# EAGLE design gyro (EAGLE 9.4.2)
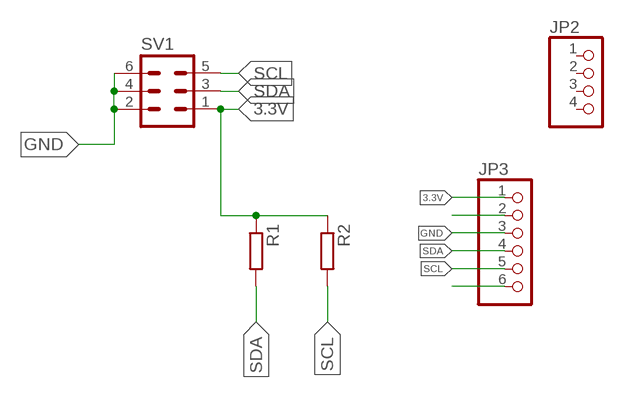
[diagram p0: schematic, sheet 1]

## Parts
JP2  PINHD-1X4  [1X04]
JP3  PINHD-1X6  [1X06]
R1  R-EU_0309/12  [0309/12]
R2  R-EU_0309/12  [0309/12]
SV1  ML6  [ML6]

## Nets
3.3V: JP3.1 R1.1 R2.1 SV1.1
GND: JP3.3 SV1.2 SV1.4 SV1.6
N$2: JP3.2
N$6: JP3.6
SCL: JP3.5 R2.2 SV1.5
SDA: JP3.4 R1.2 SV1.3
Unconnected: JP2.1 JP2.2 JP2.3 JP2.4

## Library data of the parts
JP2 = pinhead:PINHD-1X4: PIN HEADER
JP3 = pinhead:PINHD-1X6: PIN HEADER
R1 R2 = rcl:R-EU_: RESISTOR, European symbol; SPICEPREFIX: R
SV1 = con-ml:ML6: HARTING; OC_FARNELL: unknown; OC_NEWARK: unknown

## Board
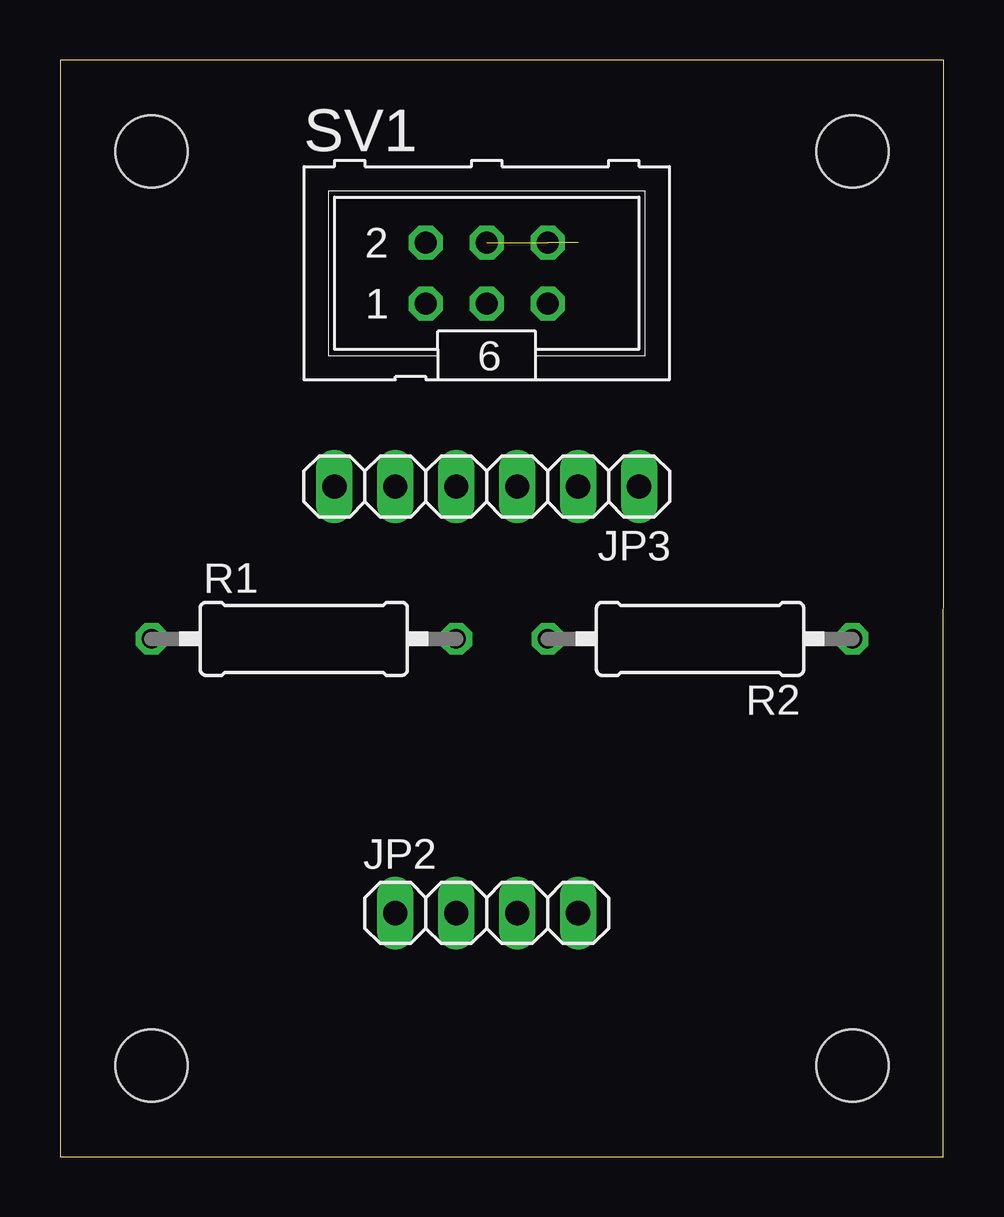
[diagram p1: board, top side]
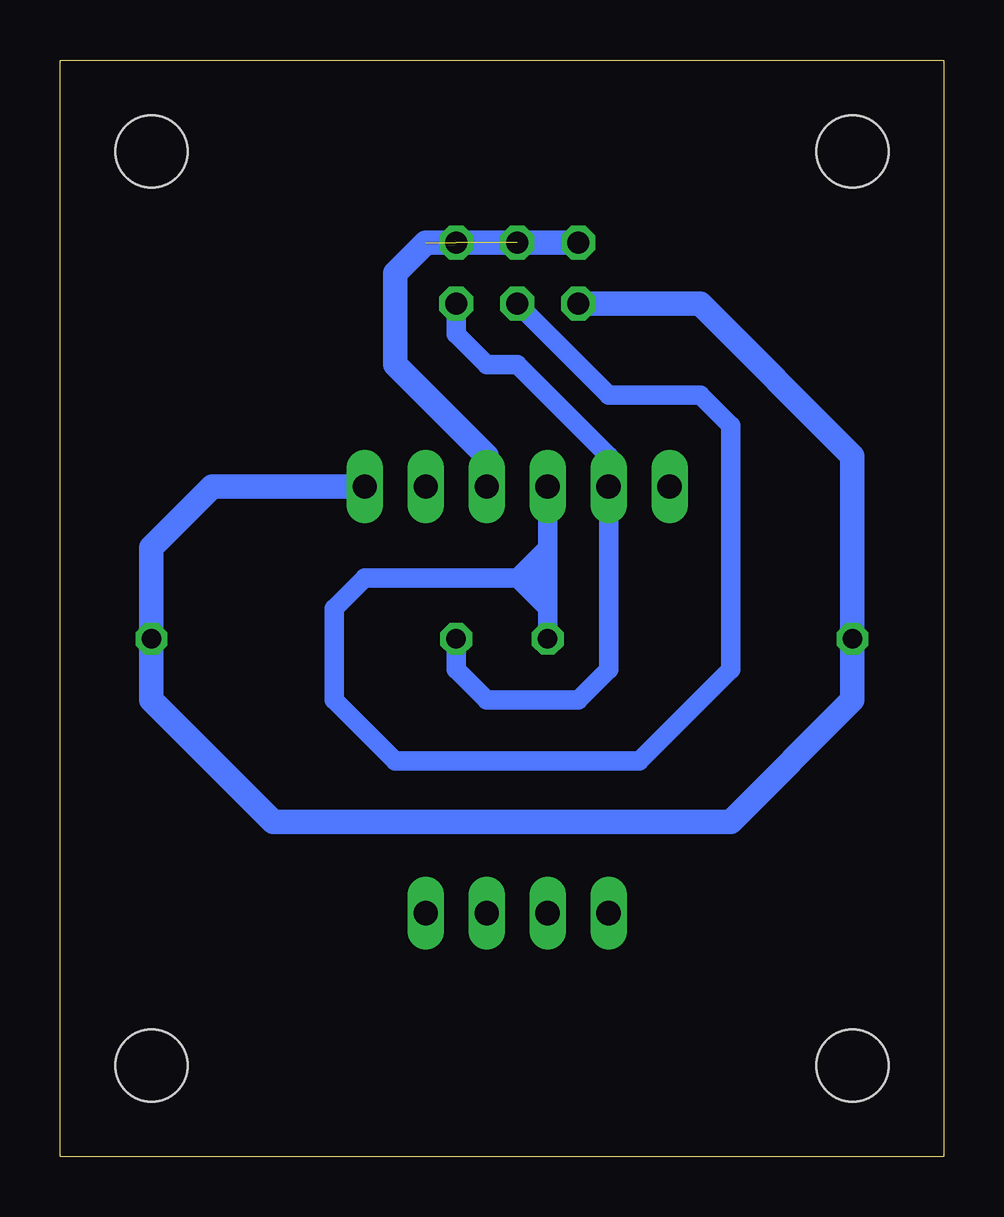
[diagram p2: board, bottom side, seen from below]

Size 36.83 x 45.72 mm. Coordinates in mm from the lower left corner, seen from the top.
Outline: 0,0 36.81,0 36.83,45.72 0,45.72 0,0
Copper layers (1*16): Top 0.035mm / dielectric 1.5mm / Bottom 0.035mm
Design rules "default": minimum track width 6mil, minimum drill 0.35mm, track to track 6mil, track to pad 6mil, pad to pad 6mil, via to via 6mil, smd to smd 6mil, copper to edge 40mil, drill to drill 6mil, minimum pad ring 10mil, minimum via ring 8mil, stop-mask expansion 4mil, vias tented up to drill 0mil, thermal gap 10mil
Holes 3 mm at 3.81,3.81 33.02,3.81 3.81,41.91 33.02,41.91

### Footprints (pad centres in the part's own frame; a part is rotated, then mirrored left to right if it is on the bottom)
1X04 = drill 1.016 long: 1 -3.81,0; 2 -1.27,0; 3 1.27,0; 4 3.81,0
1X06 = drill 1.016 long: 1 -6.35,0; 2 -3.81,0; 3 -1.27,0; 4 1.27,0; 5 3.81,0; 6 6.35,0
0309/12 = drill 0.813 octagon: 1 -6.35,0; 2 6.35,0
ML6 = drill 0.914 octagon: 1 -2.54,-1.27; 2 -2.54,1.27; 3 0,-1.27; 4 0,1.27; 5 2.54,-1.27; 6 2.54,1.27

### Placement (x,y rotation side)
JP2  17.78,10.16 0 top
JP3  17.78,27.94 180 top
R1  10.16,21.59 0 top
R2  26.67,21.59 180 top
SV1  17.78,36.83 0 top

### Tracks (layer width: path | path; a pad name or v marks a point on that pad's centre or on a via)
3.3V
  Bottom 1.016: SV1.1 10.16,35.56 3.81,29.21 R1.1 3.81,19.05 8.89,13.97 27.94,13.97 33.02,19.05 R2.1 33.02,25.4 30.48,27.94 JP3.1
GND  (2 unrouted)
  Bottom 1.016: SV1.2 21.59,38.1 22.86,36.83 22.86,33.02 19.05,29.21 JP3.3
SCL
  Bottom 0.813: SV1.5 20.32,34.29 19.05,33.02 17.78,33.02 13.97,29.21 JP3.5 13.97,20.32 15.24,19.05 19.05,19.05 20.32,20.32 R2.2
SDA
  Bottom 0.813: SV1.3 13.97,31.75 10.16,31.75 8.89,30.48 8.89,20.32 12.7,16.51 22.86,16.51 25.4,19.05 25.4,22.86 24.13,24.13 17.78,24.13 | 16.51,24.13 16.51,25.4 | 16.51,25.4 JP3.4 | 16.51,24.13 17.78,24.13 | 16.51,24.13 R1.2 16.51,22.86 17.78,24.13 | 17.78,24.13 16.51,25.4